# Altium schematic sheet 1_P1.schdoc
size 429 x 307 mm; Symbol: Drawing-Symbol_A4; Device: Drawing-Symbol_A4; @Project Name: EOTS; @Page Count: 1; @Update Date: 2026-06-20; @Create Date: 2026-06-13; @Schematic Name: Schematic1; @Page No: 1; @Page Name: P1; Company: EasyEDA.com; Version: V1.0; Page Size: A4; @Create Time: 22:09:35; @Update Time: 00:46:39; Width: 1655; Height: 1170; Region Start: 1; X Region Count: 6; Y Region Count: 4; Blade Width: 10; Title Block Position: 3; @Board Name: Board1
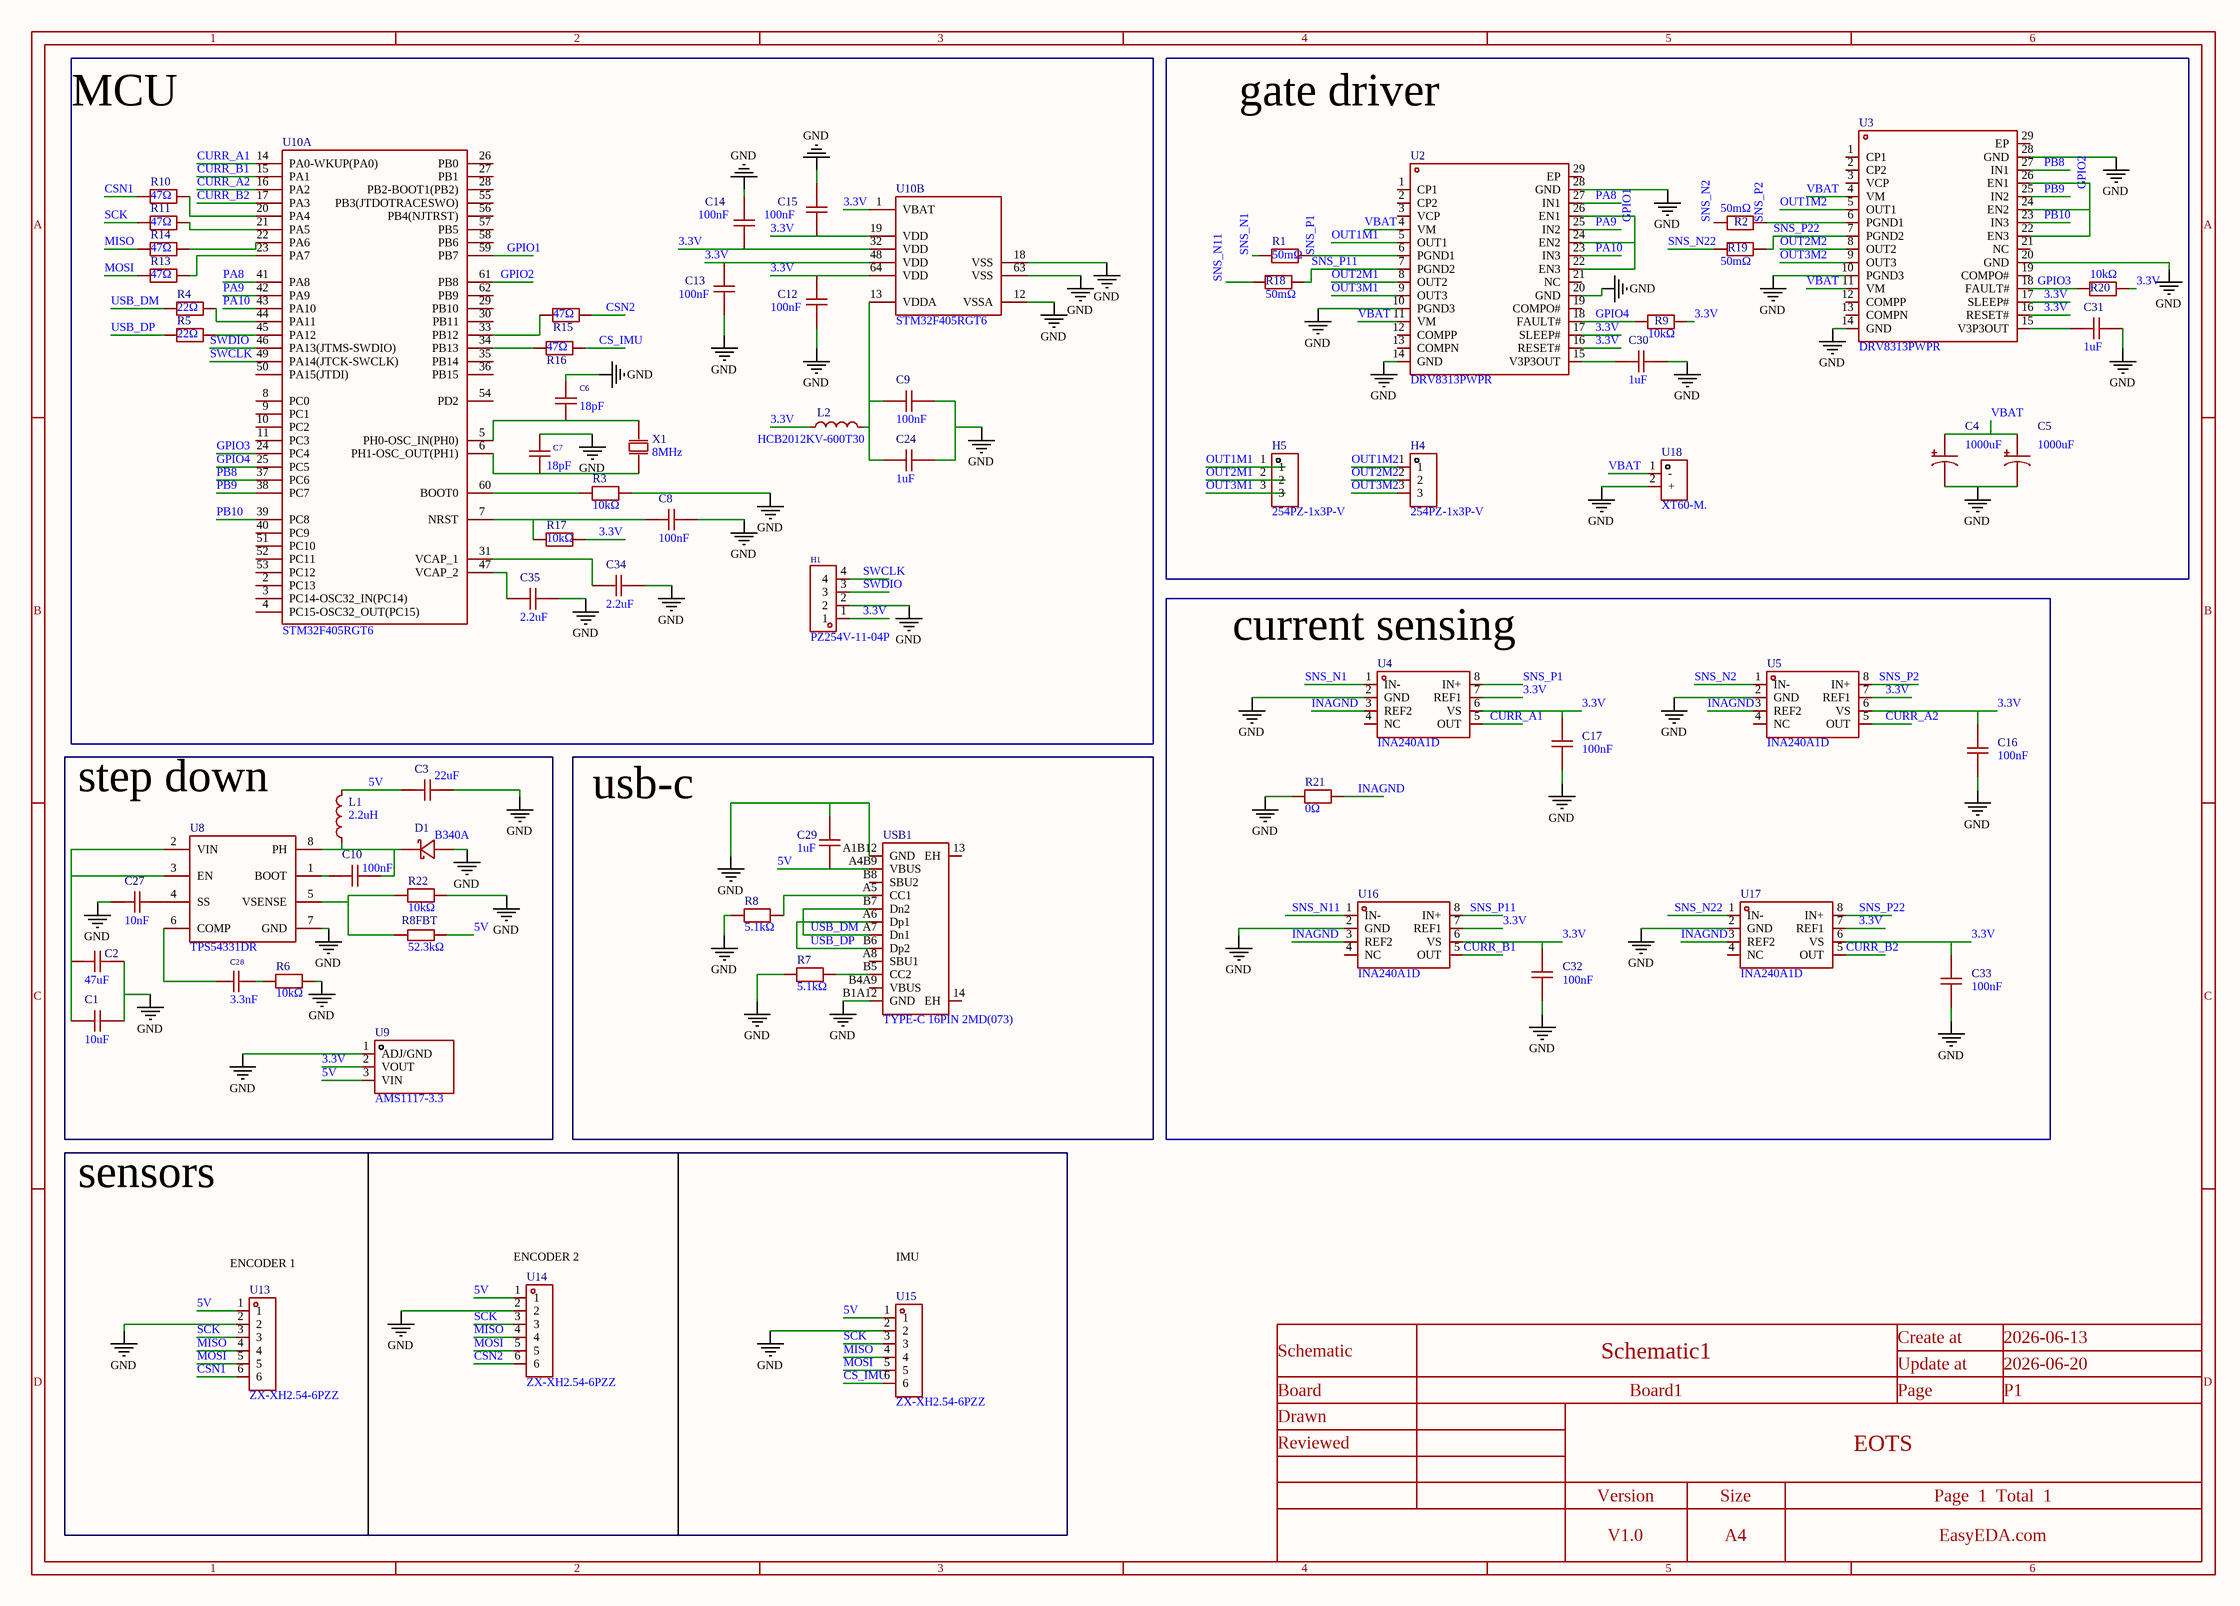
[diagram p0: 1_P1.schdoc]

## Parts
C1  10uF  [C0805]
C2  47uF  [C1206]
C3  22uF  [C0805]
C4  1000uF  [CAP-TH_BD10.0-P5.00-D1.0-FD]
C5  1000uF  [CAP-TH_BD10.0-P5.00-D1.0-FD]
C6  18pF  [C0603]
C7  18pF  [C0603]
C8  100nF  [C0805]
C9  100nF  [C0805]
C10  100nF  [C0805]
C12  100nF  [C0805]
C13  100nF  [C0805]
C14  100nF  [C0805]
C15  100nF  [C0805]
C16  100nF  [C0805]
C17  100nF  [C0805]
C24  1uF  [C0402]
C27  10nF  [C0603]
C28  3.3nF  [C0603]
C29  1uF  [C0402]
C30  1uF  [C0402]
C31  1uF  [C0402]
C32  100nF  [C0805]
C33  100nF  [C0805]
C34  2.2uF  [C0402]
C35  2.2uF  [C0402]
D1  B340A  [SMA_L4.3-W2.6-LS5.0-RD]
H1  PZ254V-11-04P  [HDR-TH_4P-P2.54-V-M]
H4  254PZ-1x3P-V  [HDR-TH_3P-P2.54-V-M]
H5  254PZ-1x3P-V  [HDR-TH_3P-P2.54-V-M]
L1  2.2uH  [IND-SMD_L2.5-W2.0_MHCHL2520]
L2  HCB2012KV-600T30  [L0805]
R1  50mΩ  [RES-SMD_L6.4-W3.2-R2512]
R2  50mΩ  [RES-SMD_L6.4-W3.2-R2512]
R3  10kΩ  [R0805]
R4  22Ω  [R0603]
R5  22Ω  [R0603]
R6  10kΩ  [R0805]
R7  5.1kΩ  [R0603]
R8  5.1kΩ  [R0603]
R8FBT  52.3kΩ  [R0603]
R9  10kΩ  [R0805]
R10  47Ω  [R0603]
R11  47Ω  [R0603]
R13  47Ω  [R0603]
R14  47Ω  [R0603]
R15  47Ω  [R0603]
R16  47Ω  [R0603]
R17  10kΩ  [R0805]
R18  50mΩ  [RES-SMD_L6.4-W3.2-R2512]
R19  50mΩ  [RES-SMD_L6.4-W3.2-R2512]
R20  10kΩ  [R0805]
R21  0Ω  [R0603]
R22  10kΩ  [R0805]
U2  DRV8313PWPR  [HTSSOP-28_L9.8-W4.5-P0.65-LS6.6-BL-EP]
U3  DRV8313PWPR  [HTSSOP-28_L9.8-W4.5-P0.65-LS6.6-BL-EP]
U4  INA240A1D  [SOIC-8_L4.9-W3.9-P1.27-LS6.0-BL]
U5  INA240A1D  [SOIC-8_L4.9-W3.9-P1.27-LS6.0-BL]
U8  TPS54331DR  [SOIC-8_L5.0-W4.0-P1.27-LS6.0-BL]
U9  AMS1117-3.3  [SOT-89-3_L4.5-W2.5-P1.50-LS4.2-BR]
U10  STM32F405RGT6  [LQFP-64_L10.0-W10.0-P0.50-LS12.0-BL]  (parts A,B of 2)
U13  ZX-XH2.54-6PZZ  [CONN-TH_6P-P2.50_ZX-XH2.54-6PZZ]
U14  ZX-XH2.54-6PZZ  [CONN-TH_6P-P2.50_ZX-XH2.54-6PZZ]
U15  ZX-XH2.54-6PZZ  [CONN-TH_6P-P2.50_ZX-XH2.54-6PZZ]
U16  INA240A1D  [SOIC-8_L4.9-W3.9-P1.27-LS6.0-BL]
U17  INA240A1D  [SOIC-8_L4.9-W3.9-P1.27-LS6.0-BL]
U18  XT60-M.  [CONN-TH_XT60]
USB1  TYPE-C 16PIN 2MD(073)  [USB-C-SMD_TYPE-C-16PIN-2MD-073]
X1  8MHz  [CRYSTAL-SMD_L5.0-W3.2]

## Blocks framed on the sheet
MCU: C6-C9 C12-C15 C24 C34 C35 H1 L2 R3-R5 R10 R11 R13-R17 U10 X1
gate driver: C4 C5 C30 C31 H4 H5 R1 R2 R9 R18-R20 U2 U3 U18
current sensing: C16 C17 C32 C33 R21 U4 U5 U16 U17
step down: C1-C3 C10 C27 C28 D1 L1 R6 R8FBT R22 U8 U9
usb-c: C29 R7 R8 USB1
sensors: U13-U15

## Nets
GND: C1.2 C2.2 C3.1 C4.2 C5.2 C6.2 C7.1 C8.2 C9.2 C12.2 C13.2 C14.2 C15.2 C16.1 C17.2 C24.1 C27.1 C29.1 C30.1 C31.1 C32.2 C33.1 C34.2 C35.2 D1.2(A) H1.2 R3.2 R6.2 R7.1 R8.1 R21.1 R22.2 U2.10(PGND3) U2.14(GND) U2.20(GND) U2.28(GND) U3.10(PGND3) U3.14(GND) U3.20(GND) U3.28(GND) U4.2(GND) U5.2(GND) U8.7(GND) U9.1(ADJ/GND) U10.12(VSSA) U10.18(VSS) U10.63(VSS) U13.2 U14.2 U15.2 U16.2(GND) U17.2(GND) U18.2(+) USB1.A1B12(GND) USB1.B1A12(GND)
3.3V: C12.1 C13.1 C14.1 C15.1 C16.2 C17.1 C32.1 C33.2 H1.1 L2.1 R9.2 R17.1 R20.2 U2.16(RESET#) U2.17(SLEEP#) U3.16(RESET#) U3.17(SLEEP#) U4.6(VS) U4.7(REF1) U5.6(VS) U5.7(REF1) U9.2(VOUT) U10.1(VBAT) U10.19(VDD) U10.32(VDD) U10.48(VDD) U10.64(VDD) U16.6(VS) U16.7(REF1) U17.6(VS) U17.7(REF1)
5V: C3.2 C29.2 L1.2 R8FBT.2 U9.3(VIN) U13.1 U14.1 U15.1 USB1.A4B9(VBUS)
CS_IMU: R16.2 U15.6
CSN1: R10.1 U13.6
CSN2: R15.2 U14.6
CURR_A1: U4.5(OUT) U10.14(PA0-WKUP(PA0))
CURR_A2: U5.5(OUT) U10.16(PA2)
CURR_B1: U10.15(PA1) U16.5(OUT)
CURR_B2: U10.17(PA3) U17.5(OUT)
GPIO1: U2.22(EN3) U2.24(EN2) U2.26(EN1) U10.59(PB7)
GPIO2: U3.22(EN3) U3.24(EN2) U3.26(EN1) U10.61(PB8)
GPIO3: R20.1 U3.18(FAULT#) U10.24(PC4)
GPIO4: R9.1 U2.18(FAULT#) U10.25(PC5)
INAGND: R21.2 U4.3(REF2) U5.3(REF2) U16.3(REF2) U17.3(REF2)
MISO: R14.1 U13.4 U14.4 U15.4
MOSI: R13.1 U13.5 U14.5 U15.5
OUT1M1: H5.1 U2.5(OUT1)
OUT1M2: H4.1 U3.5(OUT1)
OUT2M1: H5.2 U2.8(OUT2)
OUT2M2: H4.2 U3.8(OUT2)
OUT3M1: H5.3 U2.9(OUT3)
OUT3M2: H4.3 U3.9(OUT3)
PA8: U2.27(IN1) U10.41(PA8)
PA9: U2.25(IN2) U10.42(PA9)
PA10: U2.23(IN3) U10.43(PA10)
PB8: U3.27(IN1) U10.37(PC6)
PB9: U3.25(IN2) U10.38(PC7)
PB10: U3.23(IN3) U10.39(PC8)
SCK: R11.1 U13.3 U14.3 U15.3
SNS_N1: R1.2 U4.1(IN-)
SNS_N2: R2.2 U5.1(IN-)
SNS_N11: R18.2 U16.1(IN-)
SNS_N22: R19.2 U17.1(IN-)
SNS_P1: R1.1 U2.6(PGND1) U4.8(IN+)
SNS_P2: R2.1 U3.6(PGND1) U5.8(IN+)
SNS_P11: R18.1 U2.7(PGND2) U16.8(IN+)
SNS_P22: R19.1 U3.7(PGND2) U17.8(IN+)
SWCLK: H1.4 U10.49(PA14(JTCK-SWCLK))
SWDIO: H1.3 U10.46(PA13(JTMS-SWDIO))
USB_DM: R4.1 USB1.A7(Dn1) USB1.B7(Dn2)
USB_DP: R5.1 USB1.A6(Dp1) USB1.B6(Dp2)
VBAT: C4.1 C5.1 U2.4(VM) U2.11(VM) U3.4(VM) U3.11(VM) U18.1(-)
NetC1_1: C1.1 C2.1 U8.2(VIN) U8.3(EN)
NetC6_1: C6.1 U10.5(PH0-OSC_IN(PH0)) X1.1(OSC1)
NetC7_2: C7.2 U10.6(PH1-OSC_OUT(PH1)) X1.2(OSC2)
NetC8_1: C8.1 R17.2 U10.7(NRST)
NetC9_1: C9.1 C24.2 L2.2 U10.13(VDDA)
NetC10_1: C10.1 U8.1(BOOT)
NetC10_2: C10.2 D1.1(K) L1.1 U8.8(PH)
NetC27_2: C27.2 U8.4(SS)
NetC28_1: C28.1 U8.6(COMP)
NetC28_2: C28.2 R6.1
NetC30_2: C30.2 U2.15(V3P3OUT)
NetC31_2: C31.2 U3.15(V3P3OUT)
NetC34_1: C34.1 U10.31(VCAP_1)
NetC35_1: C35.1 U10.47(VCAP_2)
NetR3_1: R3.1 U10.60(BOOT0)
NetR4_2: R4.2 U10.44(PA11)
NetR5_2: R5.2 U10.45(PA12)
NetR7_2: R7.2 USB1.B5(CC2)
NetR8_2: R8.2 USB1.A5(CC1)
NetR8FBT_1: R8FBT.1 R22.1 U8.5(VSENSE)
NetR10_2: R10.2 U10.20(PA4)
NetR11_2: R11.2 U10.21(PA5)
NetR13_2: R13.2 U10.23(PA7)
NetR14_2: R14.2 U10.22(PA6)
NetR15_1: R15.1 U10.33(PB12)
NetR16_1: R16.1 U10.34(PB13)

Not connected (* = marked no-connect by the designer): U2 1(CP1) 2(CP2) 3(VCP) 12(COMPP) 13(COMPN) 19(COMPO#) 21(NC) 29(EP); U3 1(CP1) 2(CP2) 3(VCP) 12(COMPP) 13(COMPN) 19(COMPO#) 21(NC) 29(EP); U4 4(NC); U5 4(NC); U10 2(PC13) 3(PC14-OSC32_IN(PC14)) 4(PC15-OSC32_OUT(PC15)) 8(PC0) 9(PC1) 10(PC2) 11(PC3) 26(PB0) 27(PB1) 28(PB2-BOOT1(PB2)) 29(PB10) 30(PB11) 35(PB14) 36(PB15) 40(PC9) 50(PA15(JTDI)) 51(PC10) 52(PC11) 53(PC12) 54(PD2) 55(PB3(JTDOTRACESWO)) 56(PB4(NJTRST)) 57(PB5) 58(PB6) 62(PB9); U16 4(NC); U17 4(NC); USB1 13(EH) 14(EH) A8(SBU1) B4A9(VBUS) B8(SBU2)

## Notes on the sheet
- MCU
- gate driver
- CURR_A1
- CURR_B1
- 14
- 15
- U10.1
- PA0-WKUP(PA0)
- PA1
- PB0
- PB1
- 26
- 27
- GND
- U2
- 29
- 1
- 2
- U3
- CP1
- CP2
- IN1
- EP
- 28
- PB8
- CSN1
- SCK
- MISO
- 47Ω
- R10
- R11
- R14
- CURR_A2
- CURR_B2
- 16
- 17
- 20
- 21
- 22
- PA2
- PA3
- PA4
- PA5
- PA6
- PB2-BOOT1(PB2)
- PB3(JTDOTRACESWO)
- PB4(NJTRST)
- PB5
- PB6
- 55
- 56
- 57
- 58
- 3.3V
- 100nF
- C14
- C15
- 19
- U10.2
- VBAT
- VDD
- R1
- OUT1M1
- 3
- 4
- 5
- VCP
- VM
- IN2
- EN1
- 24
- 25
- PA8
- PA9
- GPIO1
- SNS_N22
- SNS_N2
- 50mΩ
- R2
- SNS_P2
- SNS_P22
- OUT1M2
- OUT2M2
- 6
- 7
- OUT1
- PGND1
- PGND2
- EN3
- IN3
- EN2
- 23
- PB9
- PB10
- GPIO2
- MOSI
- USB_DM
- R13
- R4
- PA10
- 41
- 42
- 43
- PA7
- PB7
- 59
- 61
- 62
- C13
- C12
- 13
- 32
- 48
- 64
- VDDA
- VSSA
- VSS
- 12
- 18
- 63
- SNS_N11
- SNS_N1
- R18
- SNS_P11
- SNS_P1
- OUT2M1
- OUT3M1
- 8
- 9
- 10
- OUT2
- OUT3
- NC
- R19
- OUT3M2
- 11
- PGND3
- COMPP
- SLEEP#
- FAULT#
- COMPO#
- GPIO3
- 10kΩ
- R20
- USB_DP
- 22Ω
- R5
- SWCLK
- SWDIO
- 44
- 45
- 46
- 49
- 50
- PA11
- PA12
- PA13(JTMS-SWDIO)
- PA14(JTCK-SWCLK)
- PA15(JTDI)
- PB11
- PB12
- PB13
- PB14
- PB15
- 30
- 33
- 34
- 35
- 36
- R16
- R15
- CS_IMU
- CSN2
- STM32F405RGT6
- COMPN
- V3P3OUT
- RESET#
- GPIO4
- C30
- R9
- DRV8313PWPR
- 1uF
- C31
- PC0
- PC1
- PC2
- PC3
- PD2
- PH0-OSC_IN(PH0)
- 54
- 18pF
- C6
- L2
- C9
- C4
- C5
- 37
- 38
- PC4
- PC5
- PC6
- PC7
- PH1-OSC_OUT(PH1)
- BOOT0
- 60
- C7
- R3
- 8MHz
- X1
- C8
- HCB2012KV-600T30
- C24
- H5
- H4
- XT60-M.
- U18
- -
- +
- 1000uF
- 39
- 40
- 51
- 52
- 53
- PC8
- PC9
- PC10
- PC11
- PC12
- NRST
- VCAP_1
- VCAP_2
- 31
- 47
- R17
- C34
- H1
- 254PZ-1x3P-V
- PC13
- PC14-OSC32_IN(PC14)
- PC15-OSC32_OUT(PC15)
- 2.2uF
- C35
- PZ254V-11-04P
- current sensing
- U4
- IN-
- REF1
- IN+
- U5
- C3
- INAGND
- INA240A1D
- REF2
- OUT
- VS
- C17
- C16
- step down
- U8
- 2.2uH
- L1
- 5V
- D1
- 22uF
- usb-c
- 0Ω
- R21
- C27
- VIN
- EN
- SS
- BOOT
- VSENSE
- PH
- C10
- R22
- B340A
- R8
- C29
- A1B12
- A4B9
- B8
- A5
- USB1
- VBUS
- SBU2
- CC1
- EH
- U16
- U17
- C2
- 10nF
- TPS54331DR
- COMP
- C28
- R8FBT
- 52.3kΩ
- 5.1kΩ
- R7
- B7
- A6
- A7
- B6
- A8
- Dn2
- Dp1
- Dn1
- Dp2
- SBU1
- C1
- 47uF
- 3.3nF
- R6
- U9
- B5
- B4A9
- B1A12
- TYPE-C 16PIN 2MD(073)
- CC2
- C32
- C33
- 10uF
- ADJ/GND
- VOUT
- AMS1117-3.3
- sensors
- ENCODER 1
- U13
- ENCODER 2
- U14
- U15
- IMU
- ZX-XH2.54-6PZZ
- (near U13) ENCODER 1
- (near U14) ENCODER 2
- A
- B
- C
- Schematic
- Schematic1
- Create at
- Update at
- 2026-06-13
- 2026-06-20
- D
- Board
- Drawn
- Board1
- Page
- P1
- Reviewed
- Version
- Size
- EOTS
- Page  1  Total  1
- V1.0
- A4
- EasyEDA.com

## Library data of the parts
C1 = FCC0805X106K100FT: Manufacturer: FOJAN(富捷); Add into BOM: yes; Tolerance: ±10%; Voltage Rating: 10V; Temperature Coefficient: X5R; Symbol: FCC0805X106K100FT; Device: FCC0805X106K100FT; LCSC Part Name: 10uF ±10% 10V; Supplier Part: C5137471; Manufacturer Part: FCC0805X106K100FT; Supplier Footprint: 0805; JLCPCB Part Class: Extended Part; Datasheet: https://item.szlcsc.com/datasheet/FCC0805X106K100FT/5746973.html; Supplier: LCSC; Convert to PCB: yes; Value: 10uF
C2 = TCC1206X5R476M100HT: Manufacturer: CCTC(三环); Add into BOM: yes; Tolerance: ±20%; Voltage Rating: 10V; Temperature Coefficient: X5R; Symbol: TCC1206X5R476M100HT; Device: TCC1206X5R476M100HT; LCSC Part Name: 47uF ±20% 10V; Supplier Part: C5448950; Manufacturer Part: TCC1206X5R476M100HT; Supplier Footprint: 1206; JLCPCB Part Class: Extended Part; Datasheet: https://item.szlcsc.com/datasheet/TCC1206X5R476M100HT/6350913.html; Supplier: LCSC; Convert to PCB: yes; Value: 47uF
C3 = 0805X226M160NT: Manufacturer: FH(风华); Add into BOM: yes; Tolerance: ±20%; Voltage Rating: 16V; Temperature Coefficient: X5R; Symbol: 0805X226M160NT; Device: 0805X226M160NT; LCSC Part Name: 22uF ±20% 16V; Supplier Part: C129302; Manufacturer Part: 0805X226M160NT; Supplier Footprint: 0805; JLCPCB Part Class: Extended Part; Datasheet: https://item.szlcsc.com/datasheet/0805X226M160NT/140588.html; Supplier: LCSC; Convert to PCB: yes; Value: 22uF
C4 C5 = ERR1VM102G20OT: Manufacturer: AISHI(艾华集团); Add into BOM: yes; Tolerance: ±20%; Voltage Rating: 35V; Pin Spacing: 5mm; Lifetime: 2000hrs@105℃; Symbol: ERR1VM102G20OT; Device: ERR1VM102G20OT; LCSC Part Name: 1000uF ±20% 35V; Supplier Part: C398835; Manufacturer Part: ERR1VM102G20OT; Supplier Footprint: 插件,D10xL20mm; JLCPCB Part Class: Extended Part; Datasheet: https://item.szlcsc.com/datasheet/ERR1VM102G20OT/381299.html; Supplier: LCSC; Convert to PCB: yes; Value: 1000uF; Diameter: 10mm; Height - Seated (Max): 20mm
C6 C7 = CC0603JRNPO9BN180: Manufacturer: YAGEO(国巨); Add into BOM: yes; Tolerance: ±5%; Voltage Rating: 50V; Temperature Coefficient: NP0; Symbol: CC0603JRNPO9BN180; Device: CC0603JRNPO9BN180; Supplier: LCSC; Manufacturer Part: CC0603JRNPO9BN180; Value: 18pF; Supplier Part: C107040; JLCPCB Part Class: Extended Part; LCSC Part Name: 18pF ±5% 50V; Supplier Footprint: 0603; Datasheet: https://item.szlcsc.com/datasheet/CC0603JRNPO9BN180/108256.html; Convert to PCB: yes
C8-C10 C12-C17 C32 C33 = TCC0805X7R104K500DT: Manufacturer: CCTC(三环); Add into BOM: yes; Tolerance: ±10%; Voltage Rating: 50V; Temperature Coefficient: X7R; Symbol: TCC0805X7R104K500DT; Device: TCC0805X7R104K500DT; LCSC Part Name: 100nF ±10% 50V; Supplier Part: C282732; Manufacturer Part: TCC0805X7R104K500DT; Supplier Footprint: 0805; JLCPCB Part Class: Extended Part; Datasheet: https://item.szlcsc.com/datasheet/TCC0805X7R104K500DT/268703.html; Supplier: LCSC; Convert to PCB: yes; Value: 100nF
C24 C29-C31 = TCC0402X5R105M6R3AT: Manufacturer: CCTC(三环); Add into BOM: yes; Tolerance: ±20%; Voltage Rating: 6.3V; Temperature Coefficient: X5R; Symbol: TCC0402X5R105M6R3AT; Device: TCC0402X5R105M6R3AT; LCSC Part Name: 1uF ±20% 6.3V; Supplier Part: C2887021; Manufacturer Part: TCC0402X5R105M6R3AT; Supplier Footprint: 0402; JLCPCB Part Class: Extended Part; Datasheet: https://item.szlcsc.com/datasheet/TCC0402X5R105M6R3AT/3101813.html; Supplier: LCSC; Convert to PCB: yes; Value: 1uF
C27 = FCC0603B103K500CT: Manufacturer: FOJAN(富捷); Add into BOM: yes; Tolerance: ±10%; Voltage Rating: 50V; Temperature Coefficient: X7R; Symbol: FCC0603B103K500CT; Device: FCC0603B103K500CT; LCSC Part Name: 10nF ±10% 50V; Supplier Part: C5137477; Manufacturer Part: FCC0603B103K500CT; Supplier Footprint: 0603; JLCPCB Part Class: Extended Part; Datasheet: https://item.szlcsc.com/datasheet/FCC0603B103K500CT/5746979.html; Supplier: LCSC; Convert to PCB: yes; Value: 10nF
C28 = CC0603KRX7R9BB332: Manufacturer: YAGEO(国巨); Add into BOM: yes; Tolerance: ±10%; Voltage Rating: 50V; Temperature Coefficient: X7R; Symbol: CC0603KRX7R9BB332; Device: CC0603KRX7R9BB332; Supplier: LCSC; Manufacturer Part: CC0603KRX7R9BB332; Value: 3.3nF; Supplier Part: C107088; JLCPCB Part Class: Extended Part; LCSC Part Name: 3.3nF ±10% 50V; Supplier Footprint: 0603; Datasheet: https://item.szlcsc.com/datasheet/CC0603KRX7R9BB332/108304.html; Convert to PCB: yes
C34 C35 = CGA0402X5R225M6R3GT: Manufacturer: HRE(芯声); Add into BOM: yes; Tolerance: ±20%; Voltage Rating: 6.3V; Temperature Coefficient: X5R; Symbol: CGA0402X5R225M6R3GT; Device: CGA0402X5R225M6R3GT; LCSC Part Name: 2.2uF ±20% 6.3V; Supplier Part: C7503516; Manufacturer Part: CGA0402X5R225M6R3GT; Supplier Footprint: 0402; JLCPCB Part Class: Extended Part; Datasheet: https://item.szlcsc.com/datasheet/CGA0402X5R225M6R3GT/8593414.html; Supplier: LCSC; Convert to PCB: yes; Value: 2.2uF
D1 = B340A_C48642440: Manufacturer: R+O(宏嘉诚); Add into BOM: yes; Diode Configuration: 1 Independent; Voltage - Forward(Vf@If): 550mV@3A; Voltage - DC Reverse(Vr): 40V; Current - Rectified: 3A; Reverse Leakage Current (Ir): 50uA@40V; Operating Junction Temperature Range: -55℃~+150℃; Non-Repetitive Peak Forward Surge Current: 100A; Symbol: B340A_C48642440; Device: B340A_C48642440; LCSC Part Name: 电压:40V 电流:3A; Supplier Part: C48642440; Manufacturer Part: B340A; Supplier Footprint: SMA; JLCPCB Part Class: Extended Part; Datasheet: https://item.szlcsc.com/datasheet/B340A/50921404.html; Supplier: LCSC; Convert to PCB: yes
H1 = PZ254V-11-04P: Manufacturer: XFCN(兴飞); Symbol: PZ254V-11-04P_C2691448; Add into BOM: yes; Pin Structure: 1x4P; Pitch: 2.54mm; Circluar Pins/Square Pins: Pin Header; Current Rating: 3A; Voltage Rating (Max): 250V; Device: PZ254V-11-04P; Supplier: LCSC; Supplier Part: C2691448; Manufacturer Part: PZ254V-11-04P; JLCPCB Part Class: Extended Part; LCSC Part Name: 1x4P 间距:2.54mm 方针 直插; Supplier Footprint: 插件,P=2.54mm; Datasheet: https://item.szlcsc.com/datasheet/PZ254V-11-04P/2801085.html; Convert to PCB: yes; Row Spacing: -; Mounting Type: Through Hole; Number of Rows: 1; Number of Pins: 4P; Length of Mating Pin: 6mm; Insulation Height: 2.5mm; Length of End Connection Pin: 3mm; Contact Material: -; Operating Temperature: -40℃~+105℃; Color: Black
H4 H5 = 254PZ-1x3P-V: Manufacturer: LXWCONN(连兴旺电子); Add into BOM: yes; Pin Structure: 1x3P; Pitch: 2.54mm; Circluar Pins/Square Pins: Pin Header; Current Rating: 3A; Symbol: 254PZ-1X3P-V; Device: 254PZ-1x3P-V; LCSC Part Name: 1x3P 间距:2.54mm 方针 直插; Supplier Part: C53055673; Manufacturer Part: 254PZ-1x3P-V; Supplier Footprint: 插件,P=2.54mm; JLCPCB Part Class: Extended Part; Datasheet: https://item.szlcsc.com/datasheet/254PZ-1x3P-V/55999873.html; Supplier: LCSC; Convert to PCB: yes; Mounting Type: Through Hole; Number of Rows: 1; Number of Pins: 3P; Length of Mating Pin: 6mm; Insulation Height: 2.5mm; Length of End Connection Pin: 3mm; Contact Material: Brass; Contact Plating: Gold; Operating Temperature: -40℃~+105℃; Color: Black
L1 = FTC252012S2R2MBCA: Manufacturer: cjiang(长江微电); Add into BOM: yes; Tolerance: ±20%; Rated Current: 3A; Saturation Current (Isat): 3.8A; Type: 一体成型电感; Symbol: FTC252012S2R2MBCA; Device: FTC252012S2R2MBCA; LCSC Part Name: 2.2uH ±20% 3.8A; Supplier Part: C5832372; Manufacturer Part: FTC252012S2R2MBCA; Supplier Footprint: 1008; JLCPCB Part Class: Extended Part; Datasheet: https://atta.szlcsc.com/upload/public/pdf/source/20230602/8FFEDA9C0247A92A0D4B67554BFE4091.pdf; Supplier: LCSC; Convert to PCB: yes; Value: 2.2uH
L2 = HCB2012KV-600T30: Manufacturer: TAI-TECH(台庆); Add into BOM: yes; Impedance @ Frequency: 60Ω; Tolerance: ±25%; Symbol: HCB2012KV-600T30; Device: HCB2012KV-600T30; LCSC Part Name: 车载品-2mm*1.2mm-60?-±25%; Supplier Part: C5139922; Manufacturer Part: HCB2012KV-600T30; Supplier Footprint: 0805; JLCPCB Part Class: Extended Part; Supplier: LCSC; Convert to PCB: yes
R1 R2 R18 R19 = RE2512F3R050: Manufacturer: JIERR(捷而瑞); Add into BOM: yes; Tolerance: ±1%; Power(Watts): 3W; Temperature Coefficient: ±50ppm/℃; Symbol: RE2512F3R050; Device: RE2512F3R050; LCSC Part Name: 50mΩ 3W 2512 ±1%; Supplier Part: C46961759; Manufacturer Part: RE2512F3R050; Supplier Footprint: 2512; JLCPCB Part Class: Extended Part; Datasheet: https://item.szlcsc.com/datasheet/RE2512F3R050/49133298.html; Supplier: LCSC; Convert to PCB: yes; Type: Current Sense Resistor；Alloy Resistor; Value: 50mΩ
R3 R6 R9 R17 R20 R22 = FRC0805J103TS: Manufacturer: FOJAN(富捷); Add into BOM: yes; Tolerance: ±5%; Power(Watts): 125mW; Voltage-Supply(Max): 150V; Temperature Coefficient: ±100ppm/℃; Symbol: FRC0805J103TS; Device: FRC0805J103TS; LCSC Part Name: 10kΩ ±5% 125mW 厚膜电阻; Supplier Part: C2930231; Manufacturer Part: FRC0805J103TS; Supplier Footprint: 0805; JLCPCB Part Class: Extended Part; Supplier: LCSC; Convert to PCB: yes; Type: Thick Film Resistor; Value: 10kΩ; Operating Temperature: -55℃~+155℃
R4 R5 = FRC0603J220 TS: Manufacturer: FOJAN(富捷); Add into BOM: yes; Tolerance: ±5%; Power(Watts): 100mW; Voltage-Supply(Max): 75V; Temperature Coefficient: ±100ppm/℃; Symbol: FRC0603J220 TS; Device: FRC0603J220 TS; LCSC Part Name: 22Ω ±5% 100mW 厚膜电阻; Supplier Part: C2907129; Manufacturer Part: FRC0603J220 TS; Supplier Footprint: 0603; JLCPCB Part Class: Extended Part; Supplier: LCSC; Convert to PCB: yes; Type: Thick Film Resistor; Value: 22Ω; Operating Temperature: -55℃~+155℃
R7 R8 = FRC0603F5101TS: Manufacturer: FOJAN(富捷); Add into BOM: yes; Tolerance: ±1%; Power(Watts): 100mW; Voltage-Supply(Max): 75V; Temperature Coefficient: ±100ppm/℃; Symbol: FRC0603F5101TS; Device: FRC0603F5101TS; LCSC Part Name: 5.1kΩ ±1% 100mW 厚膜电阻; Supplier Part: C2907044; Manufacturer Part: FRC0603F5101TS; Supplier Footprint: 0603; JLCPCB Part Class: Extended Part; Supplier: LCSC; Convert to PCB: yes; Type: Thick Film Resistor; Value: 5.1kΩ; Operating Temperature: -55℃~+155℃
R8FBT = 0603WAF5232T5E: Manufacturer: UNI-ROYAL(厚声); Add into BOM: yes; Tolerance: ±1%; Power(Watts): 100mW; Voltage-Supply(Max): 75V; Temperature Coefficient: ±100ppm/℃; Symbol: 0603WAF5232T5E; Device: 0603WAF5232T5E; LCSC Part Name: 52.3kΩ ±1% 100mW 厚膜电阻; Supplier Part: C23198; Manufacturer Part: 0603WAF5232T5E; Supplier Footprint: 0603; JLCPCB Part Class: Extended Part; Datasheet: https://item.szlcsc.com/datasheet/0603WAF5232T5E/23925.html; Supplier: LCSC; Convert to PCB: yes; Type: Thick Film Resistor; Value: 52.3kΩ; Operating Temperature: -55℃~+155℃
R10 R11 R13-R16 = FRC0603F47R0TS: Manufacturer: FOJAN(富捷); Add into BOM: yes; Tolerance: ±1%; Power(Watts): 100mW; Voltage-Supply(Max): 75V; Temperature Coefficient: ±100ppm/℃; Symbol: FRC0603F47R0TS; Device: FRC0603F47R0TS; LCSC Part Name: 47Ω ±1% 100mW 厚膜电阻; Supplier Part: C2907043; Manufacturer Part: FRC0603F47R0TS; Supplier Footprint: 0603; JLCPCB Part Class: Extended Part; Supplier: LCSC; Convert to PCB: yes; Type: Thick Film Resistor; Value: 47Ω; Operating Temperature: -55℃~+155℃
R21 = FRC0603P000 TS: Manufacturer: FOJAN(富捷); Add into BOM: yes; Tolerance: ±5%; Power(Watts): 100mW; Voltage-Supply(Max): 75V; Symbol: FRC0603P000 TS; Device: FRC0603P000 TS; LCSC Part Name: 0Ω ±5% 100mW 厚膜电阻; Supplier Part: C2907080; Manufacturer Part: FRC0603P000 TS; Supplier Footprint: 0603; JLCPCB Part Class: Extended Part; Supplier: LCSC; Convert to PCB: yes; Type: Thick Film Resistor; Value: 0Ω; Operating Temperature: -55℃~+155℃
U2 U3 = DRV8313PWPR: Manufacturer: TI(德州仪器); Add into BOM: yes; Drive Type: Three Phase; Number of Half Bridges: 3; Peak Current: 2.5A; Quiescent Current(Iq): 800uA; Symbol: DRV8313PWPR; Device: DRV8313PWPR; LCSC Part Name: 无刷直流BLDC电机驱动芯片 60V; Supplier Part: C92482; Manufacturer Part: DRV8313PWPR; Supplier Footprint: HTSSOP-28; JLCPCB Part Class: Extended Part; Datasheet: https://www.ti.com/cn/lit/gpn/drv8313; Supplier: LCSC; Convert to PCB: yes; Integrated FETs: Yes; Output Current: -; Voltage - Supply: -; RDS(on): -; Interface: -; Operating Temperature: -40℃~+125℃
U4 U5 U16 U17 = INA240A1D: Manufacturer: TI(德州仪器); Add into BOM: yes; Number of Channels: 1; Vcm - Common Mode Voltage: -4V~80V; Gain: 20V/V; Bandwidth: 400kHz; Ib - Input Bias Current: 90uA; Vos - Input Offset Voltage: 5uV; Differential Voltage: -80V~+80V; Single Supply: 2.7V~5.5V; Quiescent Current: 1.8mA; Input Offset Voltage Drift(Vos TC): 250nV/℃; Slew Rate: 2V/us; Common Mode Rejection Ratio (CMRR): 132dB; Noise density(eN): 40nV/√Hz@1kHz; Symbol: INA240A1D; Device: INA240A1D; LCSC Part Name: 电流检测放大器指南; Supplier Part: C1346458; Manufacturer Part: INA240A1D; Supplier Footprint: SOIC-8; JLCPCB Part Class: Extended Part; Datasheet: https://www.ti.com/cn/lit/gpn/ina240; Supplier: LCSC; Convert to PCB: yes; Operating Temperature: -40℃~+125℃; Maximum Power Supply Range (Vdd-Vss): -; Dual Supply: -; Output Current: -; Input Offset Current(Ios): -; Input Offset Current Drift (Ios TC): -
U8 = TPS54331DR: Manufacturer: TI(德州仪器); Add into BOM: yes; Function: Step-down type; Voltage - Supply: 3.5V~28V; Output Voltage: 800mV~25V; Output Current: 3A; Frequency - Switching: 570kHz; Synchronous Rectifier: No; Number of Outputs: 1; Topology: Buck; Quiescent Current: 110uA; Switch tube (built-in/external): Built-in; Output Type: Adjustable; Symbol: TPS54331DR; Device: TPS54331DR; LCSC Part Name: 降压型 3A 3.5V~28V; Supplier Part: C9865; Manufacturer Part: TPS54331DR; Supplier Footprint: SOIC-8; JLCPCB Part Class: Extended Part; Datasheet: https://www.ti.com/cn/lit/gpn/tps54331; Supplier: LCSC; Convert to PCB: yes; Operating Temperature: -40℃~+150℃@(TJ); Features: Light load efficient mode；External compensation；Cycle-by-cycle current limiting；Adjustable soft-start；Overcurrent Protection
U9 = AMS1117-3.3_C6067465: Manufacturer: GOODWORK(固得沃克); Add into BOM: yes; Output Configuration: Positive; Voltage - Supply: 18V; Output Voltage: 3.3V; Output Current: 1A; Power Supply Rejection Ratio (PSRR): 70dB@(120Hz); Voltage Dropout: 1.3V@(1A); standby current: 3mA; Noise: 0.003%Vout; Output Type: Fixed; Number of Outputs: 1; Symbol: AMS1117-3.3_C6067465; Device: AMS1117-3.3_C6067465; LCSC Part Name: 3.3V 1A 18V; Supplier Part: C6067465; Manufacturer Part: AMS1117-3.3; Supplier Footprint: SOT-89; JLCPCB Part Class: Extended Part; Datasheet: https://item.szlcsc.com/datasheet/AMS1117-3.3/7006989.html; Supplier: LCSC; Convert to PCB: yes; Features: Thermal shutdown; Operating Temperature: -40℃~+125℃@(Tj)
U10 = STM32F405RGT6: Manufacturer: ST(意法半导体); Add into BOM: yes; CPU Core: ARM Cortex-M4; CPU Maximum Speed: 168MHz; Core Size: 32 Bit; Program Storage Size: 1MB; Program Memory Type: FLASH; RAM Size: 192KB; Number of I/O: 51; ADC (Bit): 12bit; Oscillator Type: Built-in; Voltage - Supply: 1.8V~3.6V; Relevance: []; Symbol: STM32F405RGT6; Device: STM32F405RGT6; LCSC Part Name: 带DSP和FPU的高性能基础系列ARM Cortex-M4 MCU，具有1 MB Flash、168 MHz CPU和ART加速器; Supplier Part: C15742; Manufacturer Part: STM32F405RGT6; Supplier Footprint: LQFP-64(10x10); JLCPCB Part Class: Extended Part; Datasheet: https://item.szlcsc.com/datasheet/STM32F405RGT6/16424.html; Supplier: LCSC; Convert to PCB: yes; EEPROM: -; DAC (Bit): 12bit; Operating Temperature: -40℃~+85℃
U13-U15 = ZX-XH2.54-6PZZ: Manufacturer: Megastar(兆星); Add into BOM: yes; Pins Structure: 1x6P; Pitch: 2.5mm; Reference Series: XH; Number of PINs Per Row: 6; Current Rating: 3A; Voltage Rating: 250V; Plastic Material: PA66; Flame Retardant Rating: UL94V-0; Z-Height of the Board: 7mm; X-Length of Bottom Edge on Board (Spacing Line): 17.5mm; Y-Width of Bottom Edge on Board: 5.9mm; Symbol: ZX-XH2.54-6PZZ; Device: ZX-XH2.54-6PZZ; LCSC Part Name: 1x6P 间距:2.5mm 直插 系列:XH; Supplier Part: C7429636; Manufacturer Part: ZX-XH2.54-6PZZ; Supplier Footprint: 插件,P=2.5mm; JLCPCB Part Class: Extended Part; Datasheet: https://item.szlcsc.com/datasheet/ZX-XH2.54-6PZZ/8427553.html; Supplier: LCSC; Convert to PCB: yes; Mounting Type: Through Hole; Number of Pins: 6P; Number of Rows: 1; Row Spacing: -; Contact Material: Brass; Contact Plating: Tin; Operating Temperature: -25℃~+85℃; Supplementary Features: -; Color: White
U18 = XT60-M.: Manufacturer: AMASS(艾迈斯); Symbol: XT60; Add into BOM: yes; Connector type: Banana plug; interface form: Male; Device: XT60-M.; LCSC Part Name: AMASS(艾迈斯)XT60模型插头出线焊接式  2P 镀金 公头XT60-M.G.Y; Supplier Part: C98733; Manufacturer Part: XT60-M.; Supplier Footprint: -; JLCPCB Part Class: Extended Part; Datasheet: https://item.szlcsc.com/datasheet/XT60-M./99943.html; Supplier: LCSC; Convert to PCB: yes; colour: Yellow
USB1 = TYPE-C 16PIN 2MD(073): Manufacturer: SHOU HAN(首韩); Add into BOM: yes; Gender: Female; Number of Contacts: 16P; Number of Ports: 1; Current Rating-Power: 3A; Voltage Rating: 5V; Connect-Disconnect Life: 10,000 Cycles; Detection color: Black; Symbol: TYPE-C 16PIN 2MD(073); Device: TYPE-C 16PIN 2MD(073); LCSC Part Name: Type-C 母 卧贴; Supplier Part: C2765186; Manufacturer Part: TYPE-C 16PIN 2MD(073); Supplier Footprint: SMD; JLCPCB Part Class: Extended Part; Datasheet: https://item.szlcsc.com/datasheet/TYPE-C%252016PIN%25202MD(073)/2901843.html; Supplier: LCSC; Convert to PCB: yes; Connector Type: Type-C; Protocol Standard: -; Mounting Type: Surface Mount, Right Angle; Supplementary Features: -; Center Height: -; Length: -; Operating Temperature: -25℃~+85℃
X1 = X50328MSB2GI: Manufacturer: YXC(扬兴晶振); Add into BOM: yes; Normal temperature Frequency Tolerance: ±10ppm; Load Capacitance: 20pF; Frequency Stability: ±20ppm; Symbol: X50328MSB2GI; Device: X50328MSB2GI; LCSC Part Name: YSX530GA 8MHZ 2P 5032 20PF ±10PPM -40~85℃ (±20PPM); Supplier Part: C115962; Manufacturer Part: X50328MSB2GI; Supplier Footprint: SMD5032-2P; JLCPCB Part Class: Basic Part; Datasheet: https://item.szlcsc.com/datasheet/X50328MSB2GI/117214.html; Supplier: LCSC; Convert to PCB: yes; Type: Crystal Oscillator; Value: 8MHz; Operating Temperature: -40℃~+85℃